# EAGLE schematic GPIO_Board_v2.1 (EAGLE 7.2.0)
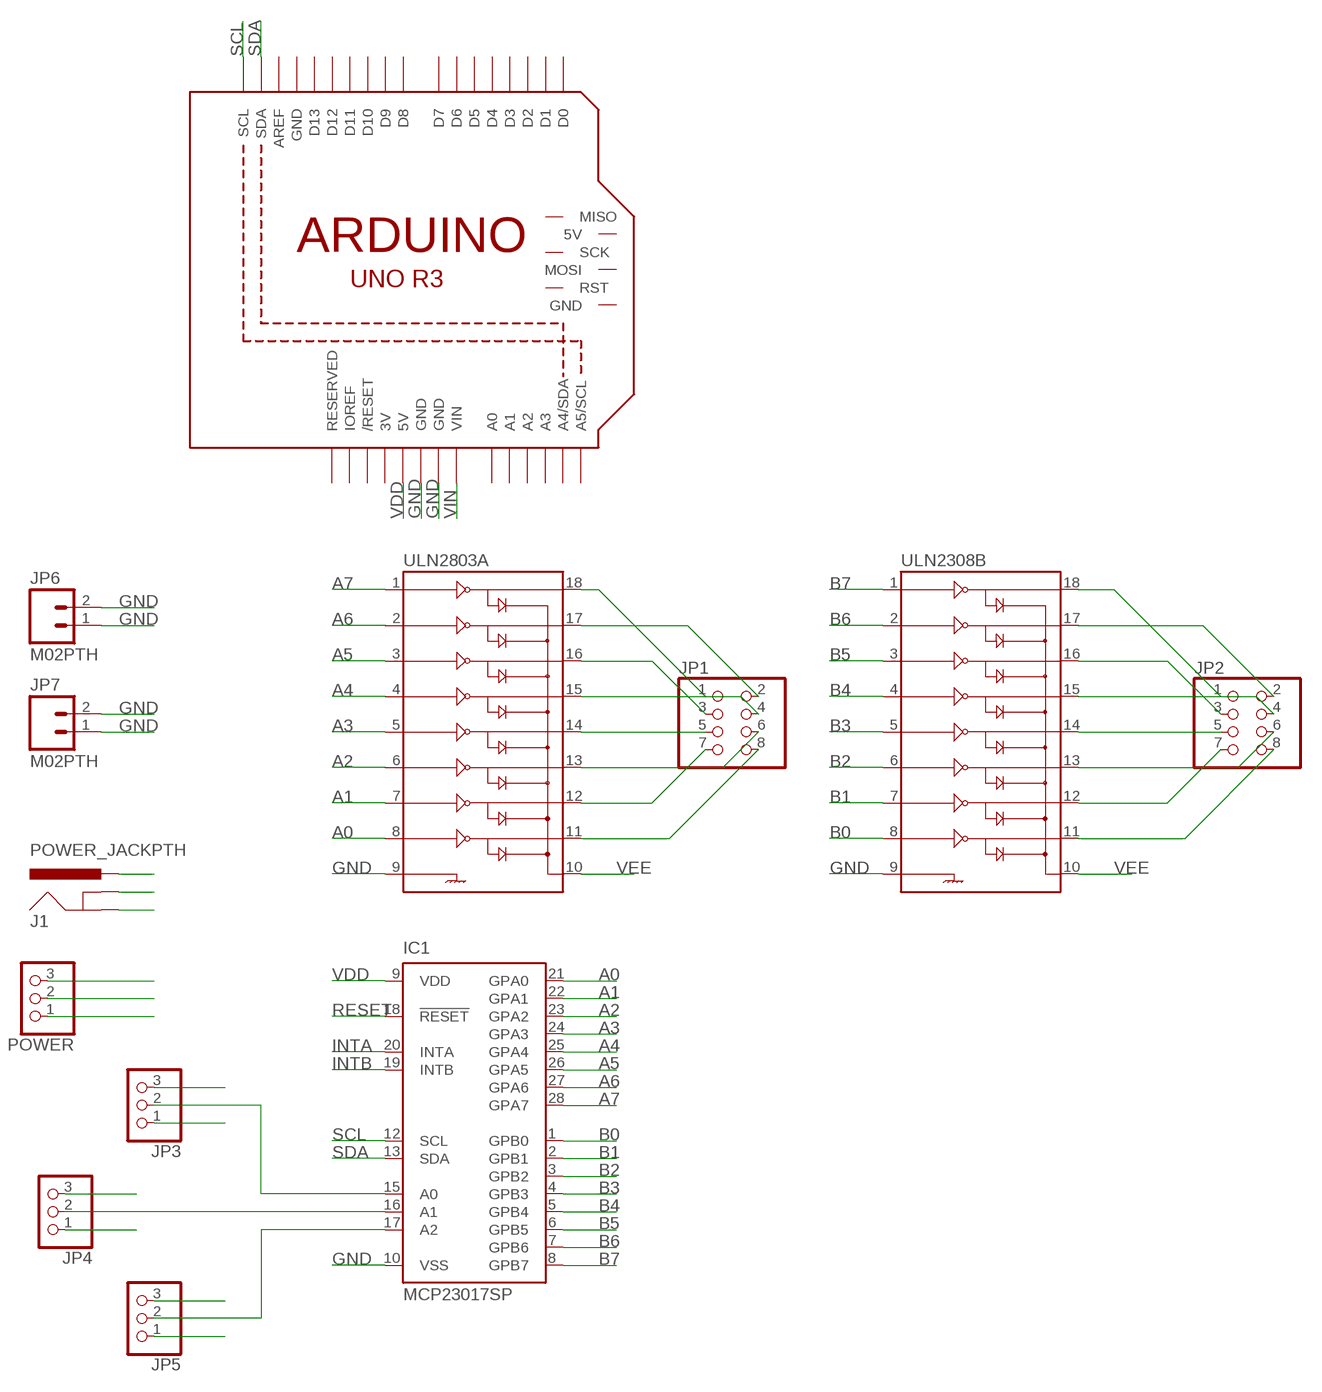
[diagram p0: schematic, sheet 1]

## Parts
IC1  MCP23017SP  [DIL28-3]
J1  POWER_JACKPTH  [POWER_JACK_PTH]
JP1  PINHD-2X4  [2X04]
JP2  PINHD-2X4  [2X04]
JP3  PINHD-1X3  [1X03]
JP4  PINHD-1X3  [1X03]
JP5  PINHD-1X3  [1X03]
JP6  M02PTH  [1X02]
JP7  M02PTH  [1X02]
M1  ARDUINO_R3_ICSP_NODIM  [ARDUINOR3_ICSP_NODIM]
POWER  PINHD-1X3  [1X03]
ULN2308B  ULN2803DIP  [DIL18]
ULN2803A  ULN2803DIP  [DIL18]

## Nets
A0: IC1.21(GPA0) ULN2803A.8
A1: IC1.22(GPA1) ULN2803A.7
A2: IC1.23(GPA2) ULN2803A.6
A3: IC1.24(GPA3) ULN2803A.5
A4: IC1.25(GPA4) ULN2803A.4
A5: IC1.26(GPA5) ULN2803A.3
A6: IC1.27(GPA6) ULN2803A.2
A7: IC1.28(GPA7) ULN2803A.1
B0: IC1.1(GPB0) ULN2308B.8
B1: IC1.2(GPB1) ULN2308B.7
B2: IC1.3(GPB2) ULN2308B.6
B3: IC1.4(GPB3) ULN2308B.5
B4: IC1.5(GPB4) ULN2308B.4
B5: IC1.6(GPB5) ULN2308B.3
B6: IC1.7(GPB6) ULN2308B.2
B7: IC1.8(GPB7) ULN2308B.1
GND: IC1.10(VSS) J1.GND J1.GNDBREAK JP3.1 JP4.1 JP5.1 JP6.1 JP6.2 JP7.1 JP7.2 M1.GND@1(GND) M1.GND@3(GND) ULN2308B.9 ULN2803A.9
INTA: IC1.20(INTA)
INTB: IC1.19(INTB)
N$1: JP1.1 ULN2803A.18
N$2: JP1.2 ULN2803A.17
N$3: JP1.3 ULN2803A.16
N$4: JP1.4 ULN2803A.15
N$5: JP1.5 ULN2803A.14
N$6: JP1.6 ULN2803A.13
N$7: IC1.17(A2) JP5.2
N$8: JP1.7 ULN2803A.12
N$9: JP1.8 ULN2803A.11
N$11: JP2.1 ULN2308B.18
N$12: JP2.2 ULN2308B.17
N$13: JP2.3 ULN2308B.16
N$14: JP2.4 ULN2308B.15
N$15: JP2.5 ULN2308B.14
N$16: JP2.6 ULN2308B.13
N$17: JP2.7 ULN2308B.12
N$18: JP2.8 ULN2308B.11
N$19: IC1.16(A1) JP4.2
N$20: IC1.15(A0) JP3.2
RESET: IC1.18(!RESET)
SCL: IC1.12(SCL) M1.SCL
SDA: IC1.13(SDA) M1.SDA
VCC: J1.PWR POWER.3
VDD: IC1.9(VDD) JP3.3 JP4.3 JP5.3 M1.5V
VEE: POWER.2 ULN2308B.10 ULN2803A.10
VIN: M1.VIN POWER.1
Unconnected: M1.5V_ICSP(5V) M1.A0 M1.A1 M1.A2 M1.A3 M1.A4(A4/SDA) M1.A5(A5/SCL) M1.AREF M1.D0 M1.D1 M1.D2 M1.D3 M1.D4 M1.D5 M1.D6 M1.D7 M1.D8 M1.D9 M1.D10 M1.D11 M1.D12 M1.D13 M1.GND@2(GND) M1.IOREF M1.MISO M1.MOSI M1.RESERVED M1.RESET(/RESET) M1.RESET_ICSP(RST) M1.SCK

## Power pins joined to a net without a drawn wire
3V: M1.3V
GND: M1.GND

## Library data of the parts
IC1 = adafruit:MCP23017: http://ww1.microchip.com/downloads/en/DeviceDoc/21952a.pdf Source: http://ww1.microchip.com/downloads/en/DeviceDoc/21952a.pdf
J1 = SparkFun-Connectors:POWER_JACK: Power Jack This is the standard 5.5mm barrel jack for power. The PTH is the most common, proven, reliable, footprint. The Slot footprint only works if the mill layer is transmitted to the PCB fab house so be warned. Mating wall wart : TOL-00298 (and others); PROD_ID: CONN-08197
JP1 JP2 = adafruit:PINHD-2X4: PIN HEADER
JP3-JP5 POWER = adafruit:PINHD-1X3: PIN HEADER
JP6 JP7 = SparkFun-Connectors:M02: Standard 2-pin 0.1" header. Use with - straight break away headers ( PRT-00116) - right angle break away headers (PRT-00553) - swiss pins (PRT-00743) - machine pins (PRT-00117) - female headers (PRT-00115) Molex polarized connector foot print use with: PRT-08233 with associated crimp pins and housings. 2.54_SCREWTERM for use with PRT-10571. 3.5mm Screw Terminal footprints for PRT-08084 5mm Screw Terminal footprints for use with PRT-08432
M1 = adafruit:ARDUINO_R3_ICSP
ULN2308B ULN2803A = SparkFun-PowerIC:ULN2803: Darlington Driver ULN2803 Darlington array. 500mA max per channel, 8-channel package. Spark Fun Electronics SKU : COM-00312

## Net classes
0 default: width 0.254 mm, drill 0.305 mm, clearance 0.152 mm
2 gnd: width 0.305 mm, drill 0.508 mm, clearance 0.152 mm